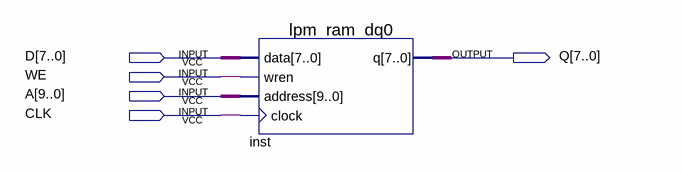
[diagram p0: schematic sheet]
// Quartus schematic ram.bdf as structural Verilog: 1 symbols, 5 pins
module ram (
  input  [7:0] D,
  input  WE,
  input  [9:0] A,
  input  CLK,
  output [7:0] Q
);

  lpm_ram_dq0 inst (.data(D), .wren(WE), .address(A), .clock(CLK), .q(Q));
endmodule
